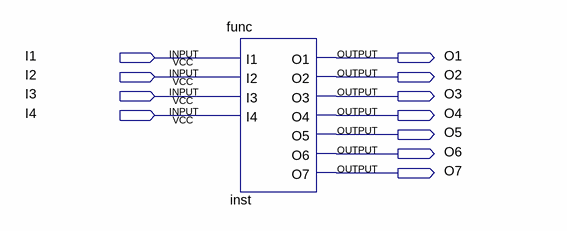
[diagram p0: schematic sheet]
// Quartus schematic lab3vn.bdf as structural Verilog: 1 symbols, 11 pins
module lab3vn (
  input  I1,
  input  I2,
  input  I3,
  input  I4,
  output O1,
  output O2,
  output O3,
  output O4,
  output O5,
  output O6,
  output O7
);

  func inst (.I1(I1), .I2(I2), .I3(I3), .I4(I4), .O1(O1), .O2(O2), .O3(O3), .O4(O4), .O5(O5), .O6(O6), .O7(O7));
endmodule
